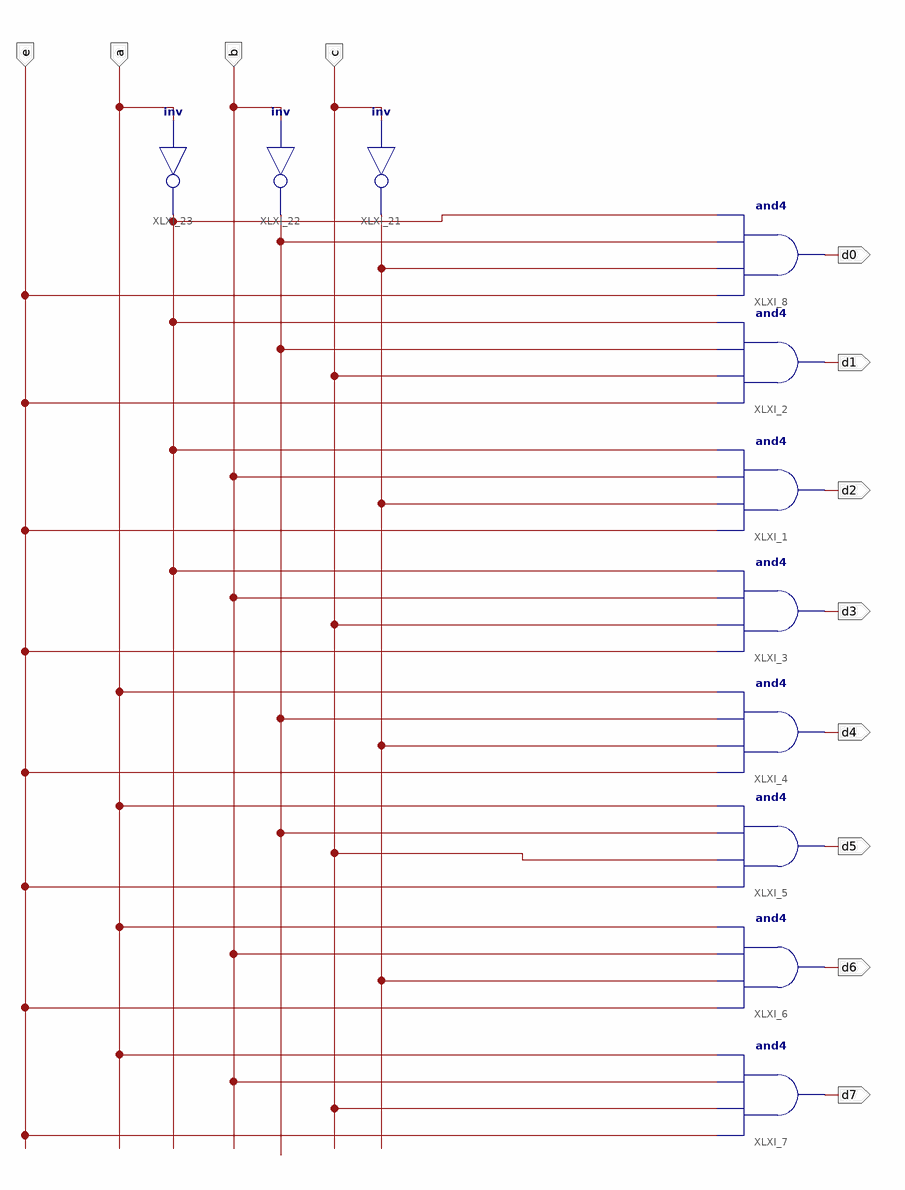
[diagram p0: schematic sheet 1]
// Xilinx ISE schematic sprinkler_circuit.sch (spartan3e) as structural Verilog: 11 symbols, 12 ports
module sprinkler_circuit (
  input  e,
  input  a,
  input  b,
  input  c,
  output d0,
  output d1,
  output d2,
  output d3,
  output d4,
  output d5,
  output d6,
  output d7
);

  wire XLXN_25, XLXN_26, XLXN_28;

  and XLXI_1 (d2, e, XLXN_28, b, XLXN_25);
  and XLXI_2 (d1, e, c, XLXN_26, XLXN_25);
  and XLXI_3 (d3, e, c, b, XLXN_25);
  and XLXI_4 (d4, e, XLXN_28, XLXN_26, a);
  and XLXI_5 (d5, e, c, XLXN_26, a);
  and XLXI_6 (d6, e, XLXN_28, b, a);
  and XLXI_7 (d7, e, c, b, a);
  and XLXI_8 (d0, e, XLXN_28, XLXN_26, XLXN_25);
  not XLXI_21 (XLXN_28, c);
  not XLXI_22 (XLXN_26, b);
  not XLXI_23 (XLXN_25, a);
endmodule
